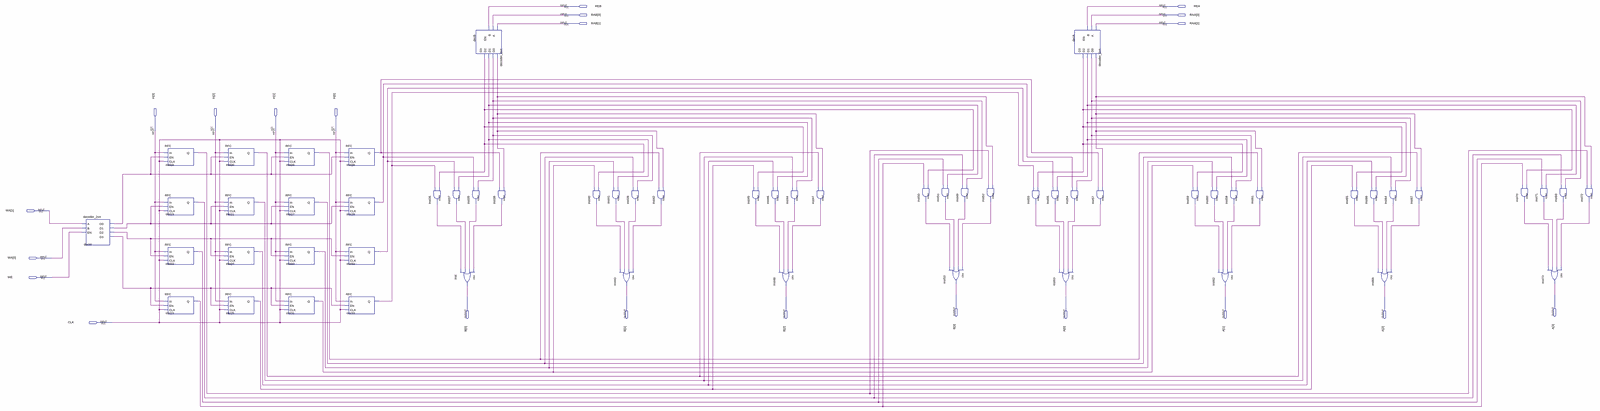
[diagram p0: schematic sheet, whole]
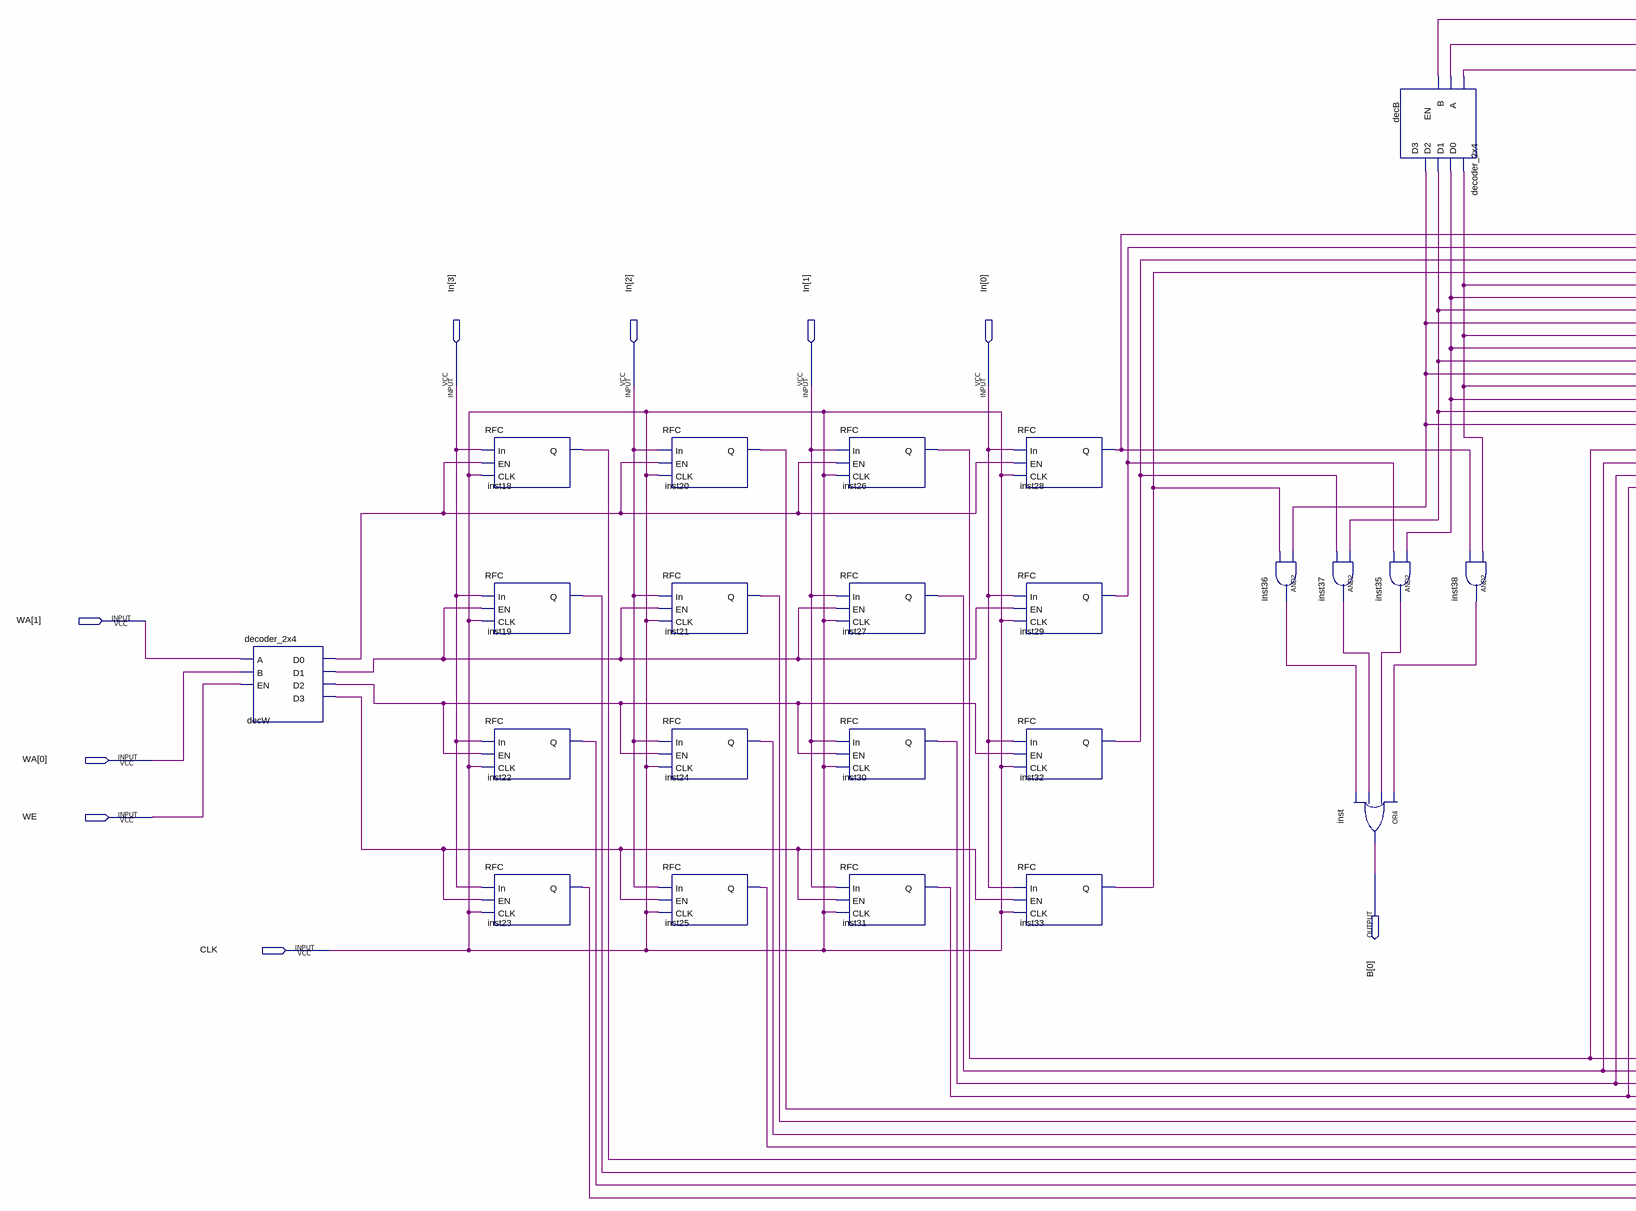
[diagram p1: schematic sheet, left part]
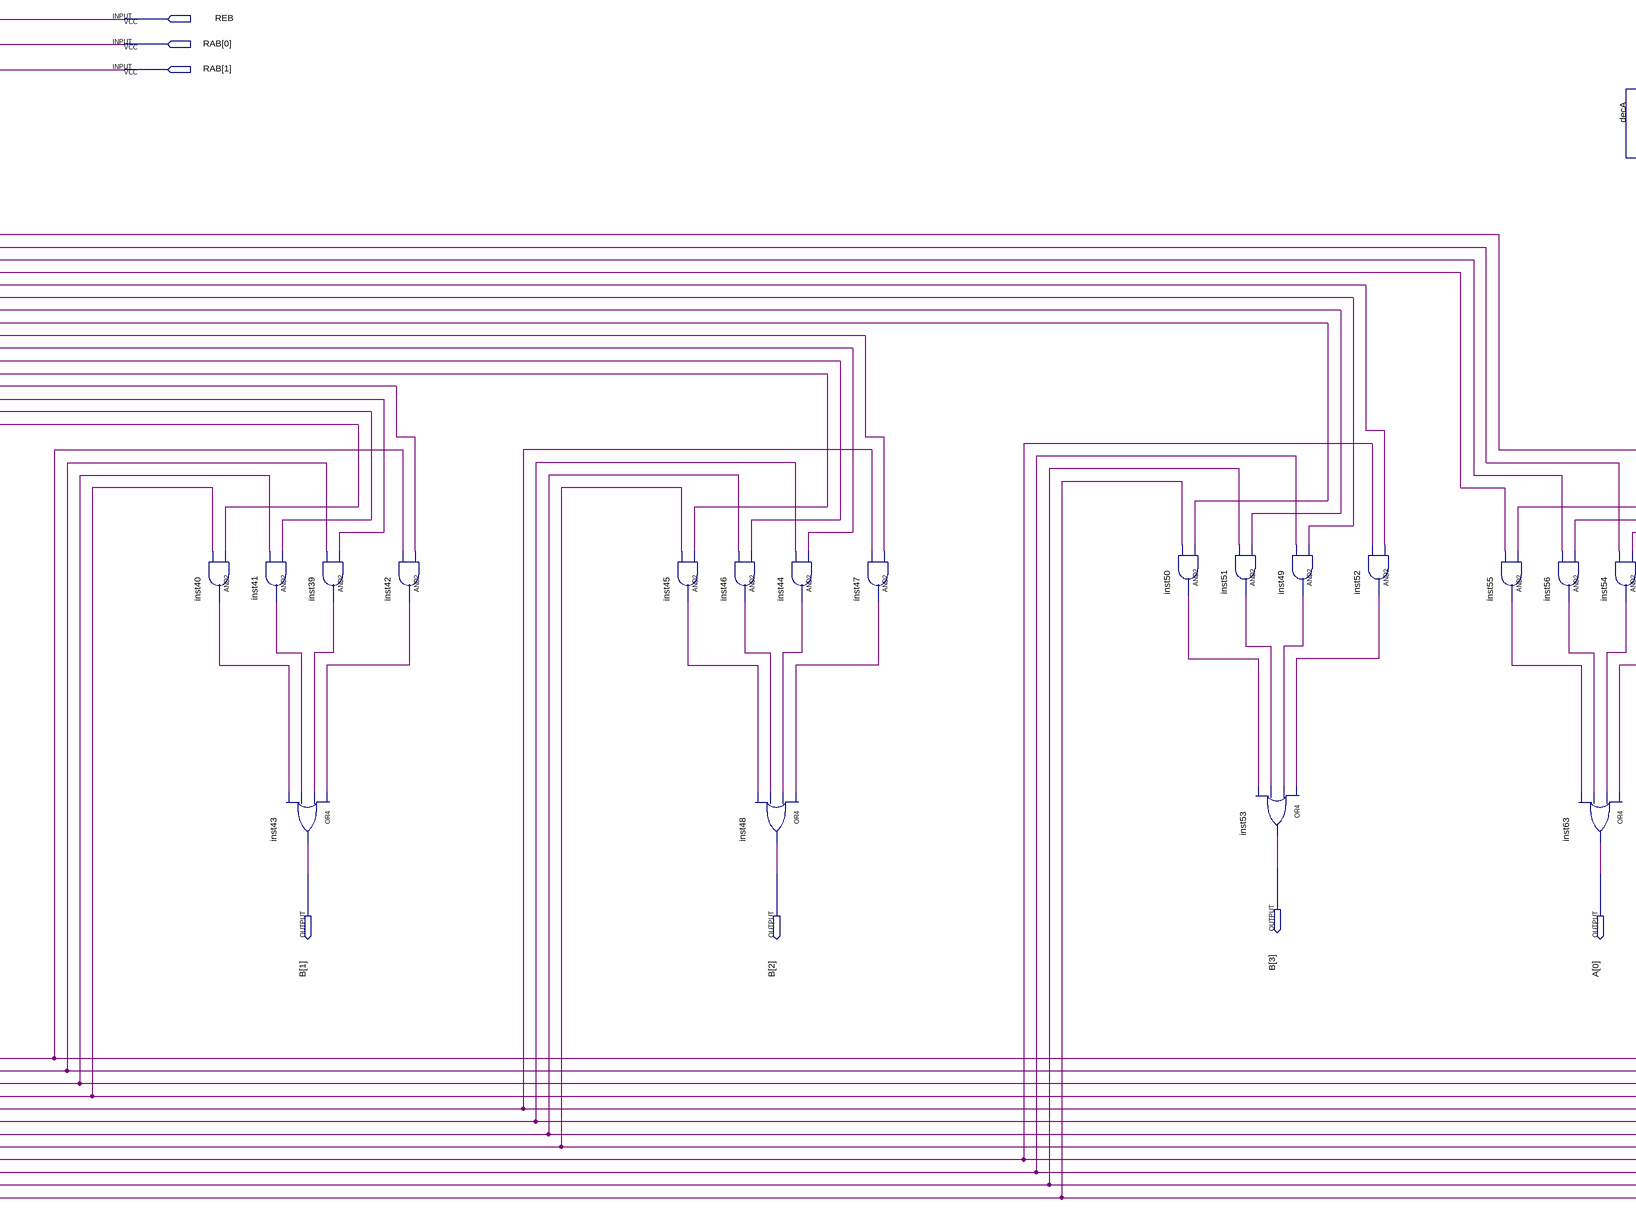
[diagram p2: schematic sheet, centre part]
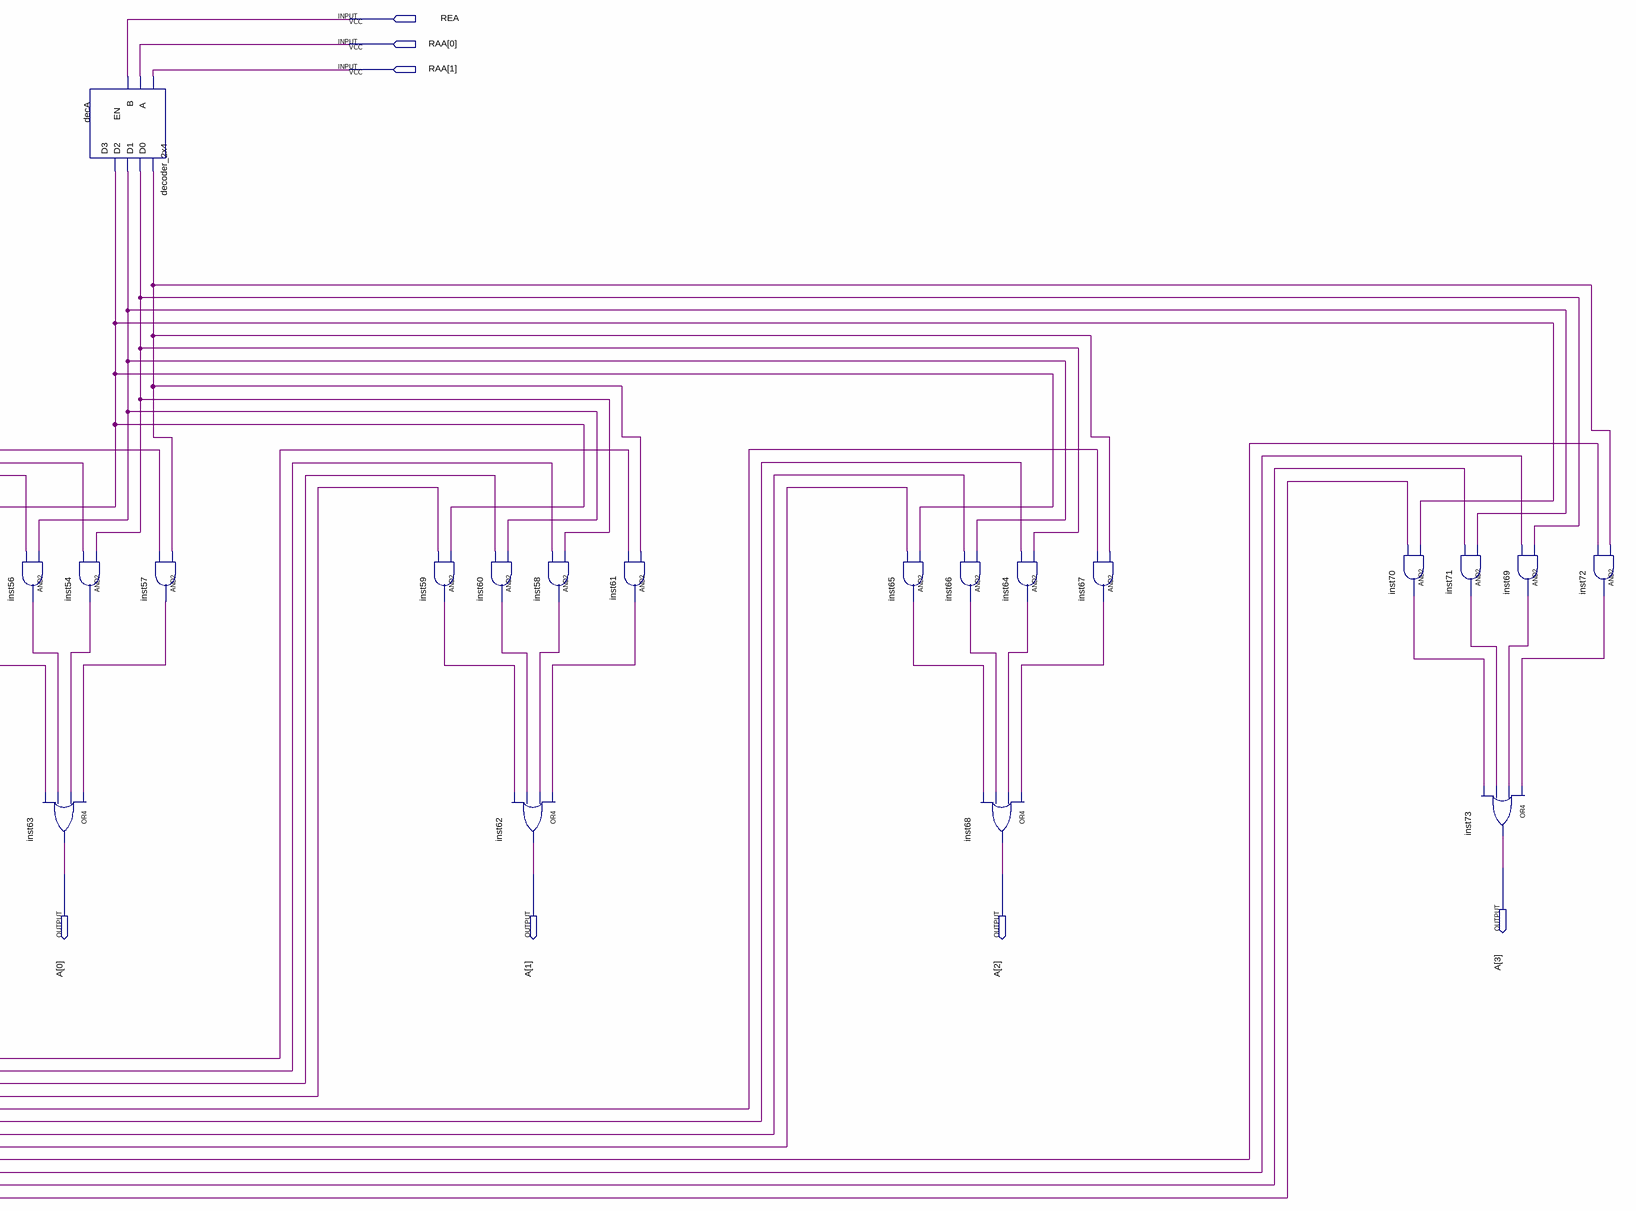
[diagram p3: schematic sheet, right part]
// Quartus schematic RegisterFile_4x4.bdf as structural Verilog: 59 symbols, 22 pins
module RegisterFile_4x4 (
  input  REB,
  input  REA,
  input  [1:0] RAB,
  input  [1:0] RAA,
  input  [3:0] In,
  input  [1:0] WA,
  input  WE,
  input  CLK,
  output [3:0] B,
  output [3:0] A
);

  wire decA_d0, decA_d1, decA_d2, decA_d3, decB_d0, decB_d1, decB_d2, decB_d3, decW_d0, decW_d1, decW_d2,
       decW_d3, inst18_q, inst19_q, inst20_q, inst21_q, inst22_q, inst23_q, inst24_q, inst25_q, inst26_q,
       inst27_q, inst28_q, inst29_q, inst30_q, inst31_q, inst32_q, inst33_q, inst35_out, inst36_out,
       inst37_out, inst38_out, inst39_out, inst40_out, inst41_out, inst42_out, inst44_out, inst45_out,
       inst46_out, inst47_out, inst49_out, inst50_out, inst51_out, inst52_out, inst54_out, inst55_out,
       inst56_out, inst57_out, inst58_out, inst59_out, inst60_out, inst61_out, inst64_out, inst65_out,
       inst66_out, inst67_out, inst69_out, inst70_out, inst71_out, inst72_out;

  decoder_2x4 decW (.A(WA[1]), .B(WA[0]), .EN(WE), .D0(decW_d0), .D1(decW_d1), .D2(decW_d2), .D3(decW_d3));
  RFC inst18 (.In(In[3]), .EN(decW_d0), .CLK(CLK), .Q(inst18_q));
  RFC inst19 (.In(In[3]), .EN(decW_d1), .CLK(CLK), .Q(inst19_q));
  RFC inst22 (.In(In[3]), .EN(decW_d2), .CLK(CLK), .Q(inst22_q));
  RFC inst23 (.In(In[3]), .EN(decW_d3), .CLK(CLK), .Q(inst23_q));
  RFC inst20 (.In(In[2]), .EN(decW_d0), .CLK(CLK), .Q(inst20_q));
  RFC inst21 (.In(In[2]), .EN(decW_d1), .CLK(CLK), .Q(inst21_q));
  RFC inst24 (.In(In[2]), .EN(decW_d2), .CLK(CLK), .Q(inst24_q));
  RFC inst25 (.In(In[2]), .EN(decW_d3), .CLK(CLK), .Q(inst25_q));
  RFC inst26 (.In(In[1]), .EN(decW_d0), .CLK(CLK), .Q(inst26_q));
  RFC inst27 (.In(In[1]), .EN(decW_d1), .CLK(CLK), .Q(inst27_q));
  RFC inst30 (.In(In[1]), .EN(decW_d2), .CLK(CLK), .Q(inst30_q));
  RFC inst31 (.In(In[1]), .EN(decW_d3), .CLK(CLK), .Q(inst31_q));
  RFC inst28 (.In(In[0]), .EN(decW_d0), .CLK(CLK), .Q(inst28_q));
  RFC inst29 (.In(In[0]), .EN(decW_d1), .CLK(CLK), .Q(inst29_q));
  RFC inst32 (.In(In[0]), .EN(decW_d2), .CLK(CLK), .Q(inst32_q));
  RFC inst33 (.In(In[0]), .EN(decW_d3), .CLK(CLK), .Q(inst33_q));
  and inst36 (inst36_out, decB_d3, inst33_q);
  and inst37 (inst37_out, decB_d2, inst32_q);
  and inst35 (inst35_out, decB_d1, inst29_q);
  or inst (B[0], inst38_out, inst35_out, inst37_out, inst36_out);
  decoder_2x4 decB (.A(RAB[1]), .B(RAB[0]), .EN(REB), .D0(decB_d0), .D1(decB_d1), .D2(decB_d2), .D3(decB_d3));
  and inst38 (inst38_out, decB_d0, inst28_q);
  and inst40 (inst40_out, decB_d3, inst31_q);
  and inst41 (inst41_out, decB_d2, inst30_q);
  or inst43 (B[1], inst42_out, inst39_out, inst41_out, inst40_out);
  and inst39 (inst39_out, decB_d1, inst27_q);
  and inst42 (inst42_out, decB_d0, inst26_q);
  and inst45 (inst45_out, decB_d3, inst25_q);
  and inst46 (inst46_out, decB_d2, inst24_q);
  or inst48 (B[2], inst47_out, inst44_out, inst46_out, inst45_out);
  and inst44 (inst44_out, decB_d1, inst21_q);
  and inst47 (inst47_out, decB_d0, inst20_q);
  and inst50 (inst50_out, decB_d3, inst23_q);
  and inst51 (inst51_out, decB_d2, inst22_q);
  or inst53 (B[3], inst52_out, inst49_out, inst51_out, inst50_out);
  and inst49 (inst49_out, decB_d1, inst19_q);
  and inst52 (inst52_out, decB_d0, inst18_q);
  and inst55 (inst55_out, decA_d3, inst33_q);
  and inst56 (inst56_out, decA_d2, inst32_q);
  or inst63 (A[0], inst57_out, inst54_out, inst56_out, inst55_out);
  decoder_2x4 decA (.A(RAA[1]), .B(RAA[0]), .EN(REA), .D0(decA_d0), .D1(decA_d1), .D2(decA_d2), .D3(decA_d3));
  and inst54 (inst54_out, decA_d1, inst29_q);
  and inst57 (inst57_out, decA_d0, inst28_q);
  and inst59 (inst59_out, decA_d3, inst31_q);
  and inst60 (inst60_out, decA_d2, inst30_q);
  and inst58 (inst58_out, decA_d1, inst27_q);
  or inst62 (A[1], inst61_out, inst58_out, inst60_out, inst59_out);
  and inst61 (inst61_out, decA_d0, inst26_q);
  and inst65 (inst65_out, decA_d3, inst25_q);
  and inst66 (inst66_out, decA_d2, inst24_q);
  or inst68 (A[2], inst67_out, inst64_out, inst66_out, inst65_out);
  and inst64 (inst64_out, decA_d1, inst21_q);
  and inst67 (inst67_out, decA_d0, inst20_q);
  and inst70 (inst70_out, decA_d3, inst23_q);
  and inst71 (inst71_out, decA_d2, inst22_q);
  or inst73 (A[3], inst72_out, inst69_out, inst71_out, inst70_out);
  and inst69 (inst69_out, decA_d1, inst19_q);
  and inst72 (inst72_out, decA_d0, inst18_q);
endmodule
